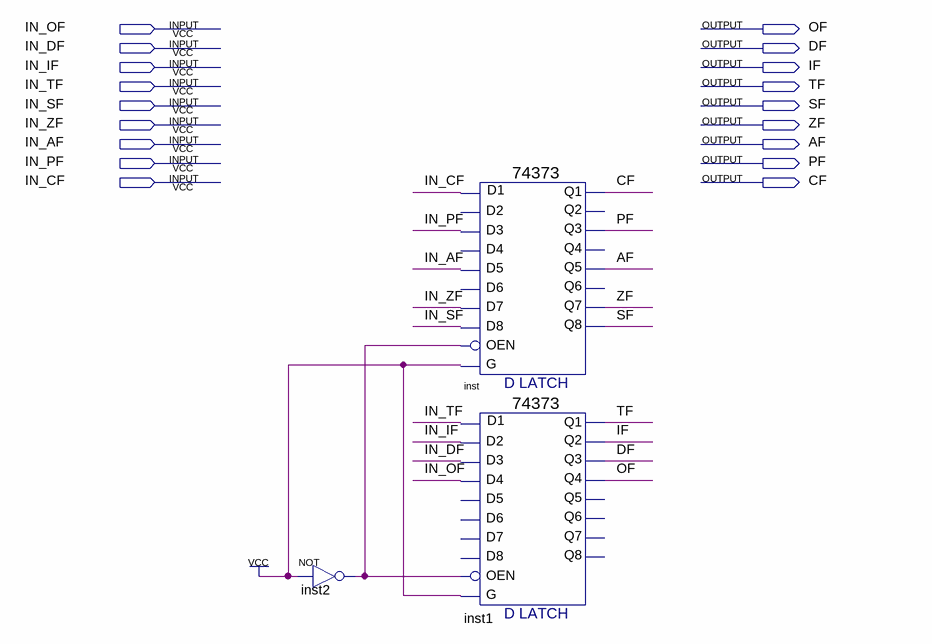
[diagram p0: schematic sheet]
// Quartus schematic FR.bdf as structural Verilog: 3 symbols, 18 pins
module FR (
  input  IN_OF,
  input  IN_DF,
  input  IN_IF,
  input  IN_TF,
  input  IN_SF,
  input  IN_ZF,
  input  IN_AF,
  input  IN_PF,
  input  IN_CF,
  output OF,
  output DF,
  output IF,
  output TF,
  output SF,
  output ZF,
  output AF,
  output PF,
  output CF
);

  wire inst2_out;

  not inst2 (inst2_out, 1'b1);
  \74373  inst (
    .D1(IN_CF), .D3(IN_PF), .D7(IN_ZF), .G(1'b1), .D5(IN_AF), .D8(IN_SF), .OEN(inst2_out), .Q3(PF), .Q7(ZF),
    .Q8(SF), .Q5(AF), .Q1(CF));  // open: D6, D2, D4, Q6, Q2, Q4
  \74373  inst1 (
    .D1(IN_TF), .D3(IN_DF), .D2(IN_IF), .G(1'b1), .D4(IN_OF), .OEN(inst2_out), .Q3(DF), .Q2(IF), .Q4(OF),
    .Q1(TF));  // open: D6, D7, D5, D8, Q6, Q7, Q8, Q5
endmodule
